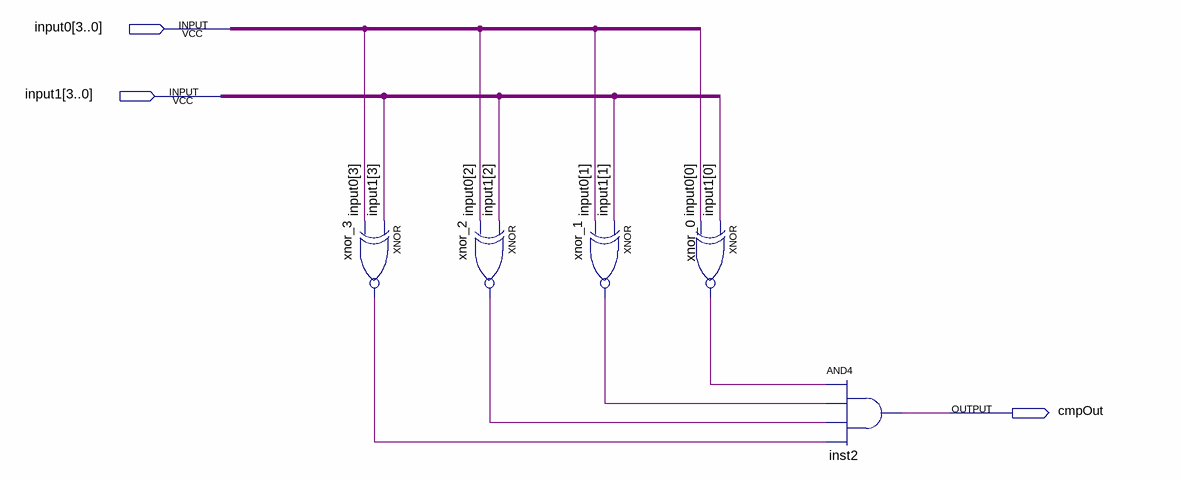
[diagram p0: schematic sheet]
// Quartus schematic EqCmp4.bdf as structural Verilog: 5 symbols, 3 pins
module EqCmp4 (
  input  [3:0] input0,
  input  [3:0] input1,
  output cmpOut
);

  wire xnor_0_out, xnor_1_out, xnor_2_out, xnor_3_out;

  xnor xnor_3 (xnor_3_out, input1[3], input0[3]);
  xnor xnor_2 (xnor_2_out, input1[2], input0[2]);
  xnor xnor_1 (xnor_1_out, input1[1], input0[1]);
  xnor xnor_0 (xnor_0_out, input1[0], input0[0]);
  and inst2 (cmpOut, xnor_0_out, xnor_1_out, xnor_2_out, xnor_3_out);
endmodule
